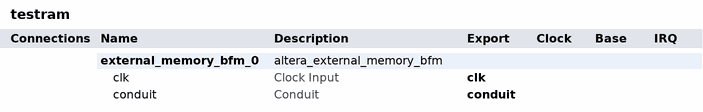
[diagram p0: system contents]
# Platform Designer (Qsys) system testram, Cyclone IV E EP4CE115F29C7
# Parameters at their usual value, and those the tool derives, are not listed.
package require -exact qsys 19.1
create_system testram
set_project_property DEVICE_FAMILY {Cyclone IV E}
set_project_property DEVICE EP4CE115F29C7

add_instance external_memory_bfm_0 altera_external_memory_bfm 19.1
set_instance_property external_memory_bfm_0 AUTO_EXPORT true
set_instance_parameter_value external_memory_bfm_0 ACTIVE_LOW_BEGINTRANSFER 0
set_instance_parameter_value external_memory_bfm_0 ACTIVE_LOW_BYTEENABLE 1
set_instance_parameter_value external_memory_bfm_0 ACTIVE_LOW_CHIPSELECT 1
set_instance_parameter_value external_memory_bfm_0 ACTIVE_LOW_OUTPUTENABLE 1
set_instance_parameter_value external_memory_bfm_0 ACTIVE_LOW_READ 1
set_instance_parameter_value external_memory_bfm_0 ACTIVE_LOW_RESET 0
set_instance_parameter_value external_memory_bfm_0 ACTIVE_LOW_WRITE 1
set_instance_parameter_value external_memory_bfm_0 CDT_ADDRESS_W 20
set_instance_parameter_value external_memory_bfm_0 CDT_NUMSYMBOLS 1
set_instance_parameter_value external_memory_bfm_0 CDT_READ_LATENCY 0
set_instance_parameter_value external_memory_bfm_0 CDT_SYMBOL_W 16
set_instance_parameter_value external_memory_bfm_0 INIT_FILE altera_external_memory_bfm.hex
set_instance_parameter_value external_memory_bfm_0 SIGNAL_ADDRESS_ROLES cdt_address
set_instance_parameter_value external_memory_bfm_0 SIGNAL_BEGINTRANSFER_ROLES cdt_begintransfer
set_instance_parameter_value external_memory_bfm_0 SIGNAL_BYTEENABLE_ROLES cdt_byteenable
set_instance_parameter_value external_memory_bfm_0 SIGNAL_CHIPSELECT_ROLES cdt_chipselect
set_instance_parameter_value external_memory_bfm_0 SIGNAL_DATA_ROLES cdt_data_io
set_instance_parameter_value external_memory_bfm_0 SIGNAL_OUTPUTENABLE_ROLES cdt_outputenable
set_instance_parameter_value external_memory_bfm_0 SIGNAL_READ_ROLES cdt_read
set_instance_parameter_value external_memory_bfm_0 SIGNAL_RESET_ROLES cdt_reset
set_instance_parameter_value external_memory_bfm_0 SIGNAL_WRITE_ROLES cdt_write
set_instance_parameter_value external_memory_bfm_0 USE_BEGINTRANSFER 0
set_instance_parameter_value external_memory_bfm_0 USE_BYTEENABLE 1
set_instance_parameter_value external_memory_bfm_0 USE_CHIPSELECT 1
set_instance_parameter_value external_memory_bfm_0 USE_OUTPUTENABLE 1
set_instance_parameter_value external_memory_bfm_0 USE_READ 1
set_instance_parameter_value external_memory_bfm_0 USE_RESET 0
set_instance_parameter_value external_memory_bfm_0 USE_WRITE 1
set_instance_parameter_value external_memory_bfm_0 VHDL_ID 0

# exported interfaces
add_interface clk clock sink
set_interface_property clk EXPORT_OF external_memory_bfm_0.clk
add_interface conduit conduit end
set_interface_property conduit EXPORT_OF external_memory_bfm_0.conduit

set_interconnect_requirement {$system} qsys_mm.clockCrossingAdapter HANDSHAKE
set_interconnect_requirement {$system} qsys_mm.enableEccProtection FALSE
set_interconnect_requirement {$system} qsys_mm.insertDefaultSlave FALSE
set_interconnect_requirement {$system} qsys_mm.maxAdditionalLatency 1

save_system testram.qsys
